# EAGLE design ADXL375_BOARD (EAGLE 9.6.1)
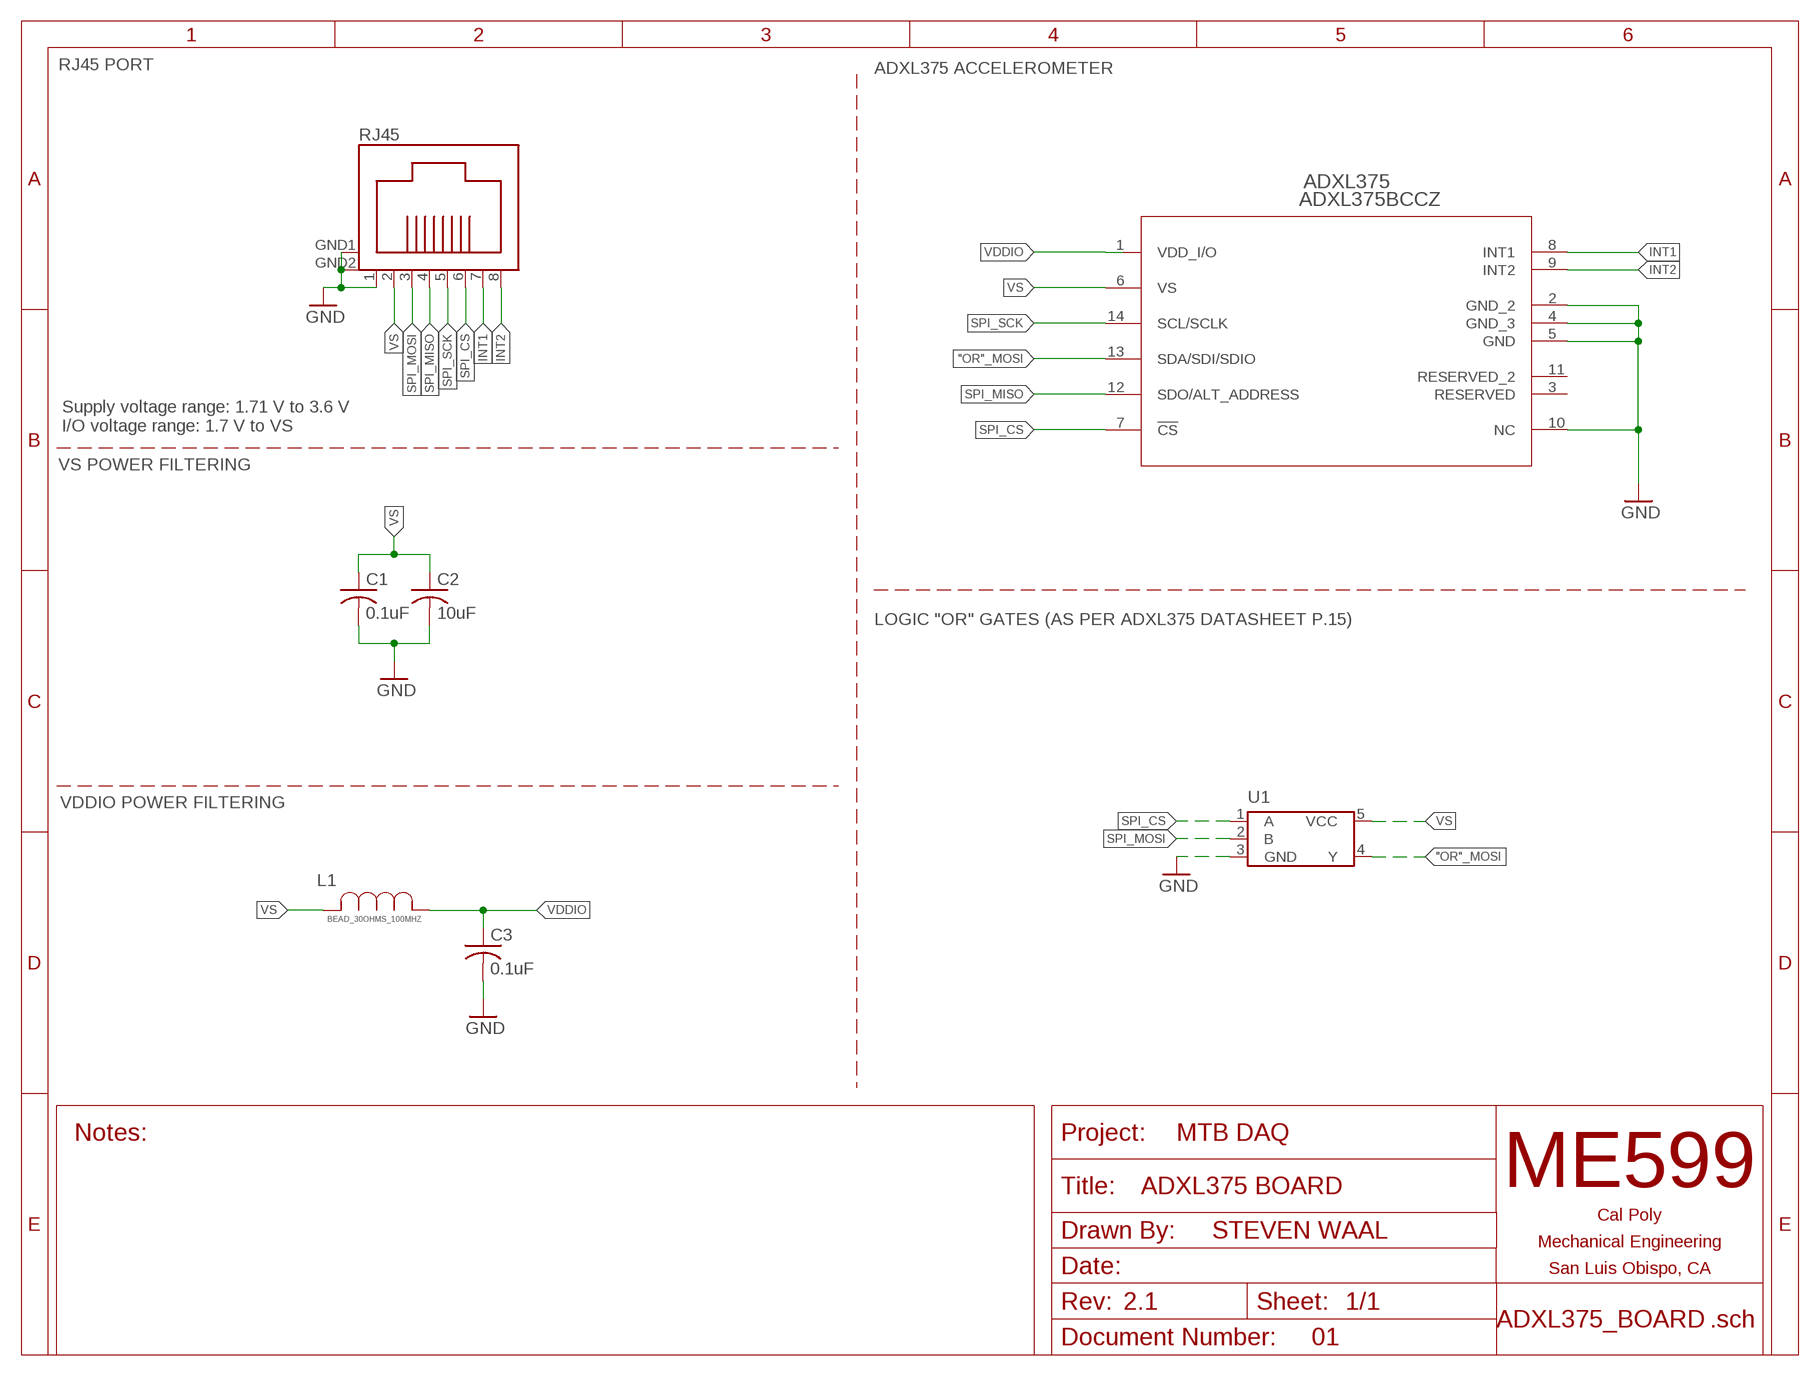
[diagram p0: schematic, sheet 1]
FRAME1 (TITLEBLOCK): AUTHOR: STEVEN WAAL; BOARD_NAME: ADXL375 BOARD; DOC_NUM: 01; PROJECT_NAME: MTB DAQ; REVISION: 2.1

## Parts
ADXL375  ADXL375BCCZ  [LGA_CC-14-1]
C1  0.1uF  C-USC0805  [C0805]
C2  10uF  C-USC0805  [C0805]
C3  0.1uF  C-USC0805  [C0805]
L1  BEAD_30OHMS_100MHZ  [IND_BOURNS_MH2029]
RJ45  RJ45_SURFACE_MOUNT  [RJ45_SURFACE_MOUNT]
U1  SN74LVC1G32DCKR  [DCK5]

## Nets
"OR"_MOSI: ADXL375.13(SDA/SDI/SDIO) U1.4(Y)
GND: ADXL375.2(GND_2) ADXL375.4(GND_3) ADXL375.5(GND) ADXL375.10(NC) C1.2 C2.2 C3.2 RJ45.1 RJ45.GND1 RJ45.GND2 U1.3(GND)
INT1: ADXL375.8(INT1) RJ45.7
INT2: ADXL375.9(INT2) RJ45.8
SPI_CS: ADXL375.7(!CS) RJ45.6 U1.1(A)
SPI_MISO: ADXL375.12(SDO/ALT_ADDRESS) RJ45.4
SPI_MOSI: RJ45.3 U1.2(B)
SPI_SCK: ADXL375.14(SCL/SCLK) RJ45.5
VDDIO: ADXL375.1(VDD_I/O) C3.1 L1.1
VS: ADXL375.6(VS) C1.1 C2.1 L1.2 RJ45.2 U1.5(VCC)
Unconnected: ADXL375.3(RESERVED) ADXL375.11(RESERVED_2)

## Notes on the sheet
- RJ45 PORT | ADXL375 ACCELEROMETER
- Supply voltage range: 1.71 V to 3.6 V 
  I/O voltage range: 1.7 V to VS
- VS POWER FILTERING
- LOGIC "OR" GATES (AS PER ADXL375 DATASHEET P.15)
- VDDIO POWER FILTERING

## Library data of the parts
ADXL375 = DigikeyLibrary:ADXL375BCCZ: Accelerometer X, Y, Z Axis ±200g 0.05Hz ~ 1.6kHz 14-LGA (3x5) Digikey Part No: ADXL375BCCZ-ND Link: https://www.digikey.com/product-detail/en/analog-devices-inc/ADXL375BCCZ/ADXL375BCCZ-ND/4376342; MANUFACTURER_PART_NUMBER: ADXL375BCCZ; VENDOR: Analog Devices Inc
C1-C3 = DigikeyLibrary:C-US: CAPACITOR, American symbol; SPICEPREFIX: C
L1 = DigikeyLibrary:BEAD_30OHMS_100MHZ: 30 Ohms @ 100MHz 1 Power, Signal Line Ferrite Bead 0805 (2012 Metric) 3A 25 mOhm Digikey Part No: MH2029-300YCT-ND Link: https://www.digikey.com/product-detail/en/bourns-inc/MH2029-300Y/MH2029-300YCT-ND/3741761; MANUFACTURER_PART_NUMBER: MH2029300Y; VENDOR: Bourns Electronics
RJ45 = DigikeyLibrary:RJ45_SURFACE_MOUNT: Digikey Part No. RJCSE538001CT-ND MFG. Amphenol ICC (Commercial Products) MFG. PART NO. RJCSE538001
U1 = DigikeyLibrary:SN74LVC1G32DCKR: Logic "OR" Gate Digi-Key Part Number 296-9848-1-ND Manufacturer Texas Instruments Manufacturer Part Number SN74LVC1G32DCKR Customer Reference Number Description IC GATE OR 1CH 2-INP SC70-5 Manufacturer Standard Lead Time 6 Weeks Detailed Description OR Gate IC 1 Channel SC-70-5; BUILT_BY: EMA_UL_Team; MANUFACTURER: Texas Instruments; MANUFACTURER_PART_NUMBER: SN74LVC1G32DCKR; VENDOR: Texas Instruments

## Board
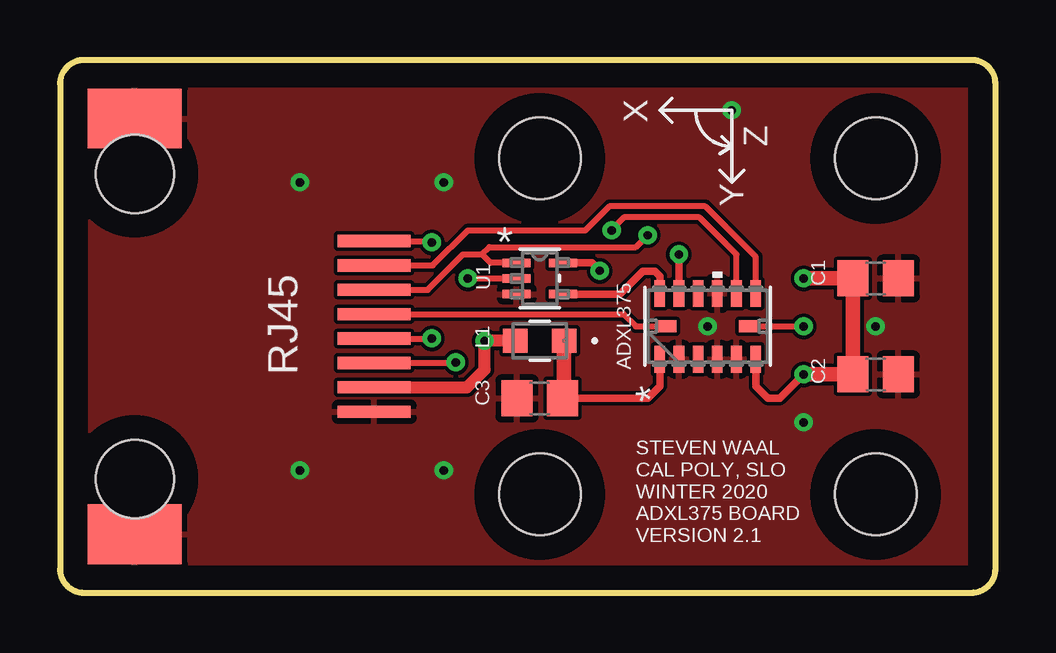
[diagram p1: board, top side]
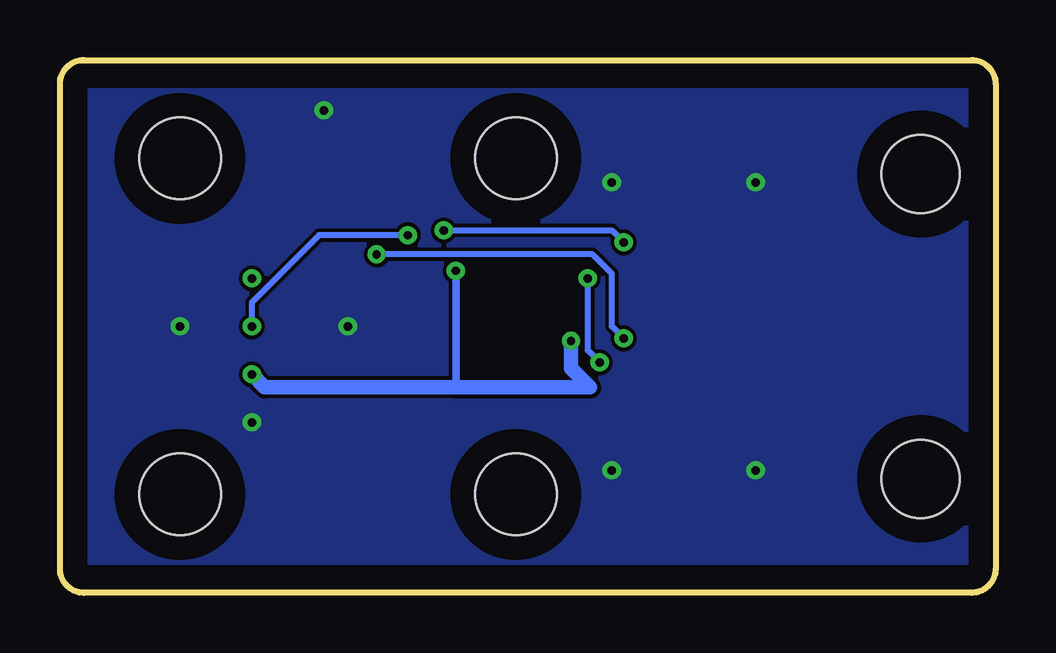
[diagram p2: board, bottom side, seen from below]

Size 39 x 22.2 mm. Coordinates in mm from the lower left corner, seen from the top.
Outline: 39,1 39,21.2 arc90 38,22.2 1,22.2 arc90 0,21.2 0,1 arc90 1,0 38,0 arc90 39,1
Copper layers (1*16): Top 0.035mm / dielectric 1.5mm / Bottom 0.035mm
Design rules "default *": minimum track width 6mil, minimum drill 0.35mm, track to track 6mil, track to pad 6mil, pad to pad 6mil, via to via 6mil, smd to smd 6mil, copper to edge 40mil, drill to drill 6mil, minimum pad ring 10mil, minimum via ring 8mil, stop-mask expansion 4mil, vias tented up to drill 20mil, thermal gap 10mil
Holes 3.4 mm at 20,4.1 34,18.1 34,4.1 20,18.1

### Footprints (pad centres in the part's own frame; a part is rotated, then mirrored left to right if it is on the bottom)
LGA_CC-14-1 = smd 1.118 x 0.449: 1 -1.371,2; 2 -1.371,1.2; 3 -1.371,0.4; 4 -1.371,-0.4; 5 -1.371,-1.2; 6 -1.371,-2; 8 1.371,-2; 9 1.371,-1.2; 10 1.371,-0.4; 11 1.371,0.4; 12 1.371,1.2; 13 1.371,2 | smd 0.5 x 0.813: 7 0,-1.718; 14 0,1.718
C0805 = smd 1.3 x 1.5: 1 -0.95,0; 2 0.95,0
IND_BOURNS_MH2029 = smd 1.016 x 1.016: 1 -1.016,0; 2 1.016,0
RJ45_SURFACE_MOUNT = smd 0.508 x 3.048: 1 3.556,0; 2 2.54,0; 3 1.524,0; 4 0.508,0; 5 -0.508,0; 6 -1.524,0; 7 -2.54,0; 8 -3.556,0 | smd 2.489 x 3.912: GND1 8.661,-9.982; GND2 -8.661,-9.982 | hole 3.251: 6.35,-9.982; -6.35,-9.982
DCK5 = smd 1.168 x 0.356: 1 -0.965,0.65; 2 -0.965,0; 3 -0.965,-0.65; 4 0.965,-0.65; 5 0.965,0.65

### Placement (x,y rotation side)
ADXL375  27,11.1 90 top
C1  34,13.1 0 top
C2  34,9.1 0 top
C3  20,8.1 180 top
L1  20,10.5 180 top
RJ45  13.1,11.1 270 top
U1  20,13.1 0 top

### Tracks (layer width: path | path; a pad name or v marks a point on that pad's centre or on a via)
"OR"_MOSI
  Top 0.305: U1.4 23.35,12.45 24.3,13.4 24.8,13.4 25,13.2 ADXL375.13
GND  (via drill 0.35)
  other vias: 28,20.1 16,17.1 10,5.1 16,5.1 34,11.1 10,17.1 31,7.1 27,11.1
  pour Top: -2,23.1 -2,-1.9 40,-1.9 40,23.1
  pour Bottom: -2,23.1 -2,-0.9 40,-0.9 40,23.1
INT1
  Top 0.254: ADXL375.8 29,14 26.9,16.1 22.9,16.1 21.9,15.1 17,15.1 15.54,13.64 RJ45.7
INT2  (via drill 0.35)
  Top 0.254: ADXL375.9 28.2,14.1 26.66,15.64 23.5,15.64 23,15.14 | RJ45.8 15.44,14.66 v15.5,14.6
  Top 0.305: 23,15.14 v23,15.1
  Bottom 0.254: v23,15.1 16,15.1 v15.5,14.6
SPI_CS  (via drill 0.35)
  Top 0.254: ADXL375.7 v31,11.1 | U1.1 17.95,13.75 17.6,14.1 | RJ45.6 15.32,12.62 16.8,14.1 17.6,14.1 | 17.6,14.1 17.9,14.4 24,14.4 v24.5,14.9
  Bottom 0.254: v31,11.1 31,12.1 28.2,14.9 v24.5,14.9
SPI_MISO  (via drill 0.35)
  Top 0.254: RJ45.4 v15.49,10.59 v15.5,10.6
  Top 0.305: ADXL375.12 v25.8,14.1
  Bottom 0.254: v25.8,14.1 16.8,14.1 16,13.3 16,11.1 v15.5,10.6
SPI_MOSI  (via drill 0.35)
  Top 0.254: v17,13.1 U1.2 | RJ45.3 16.48,9.58 v16.5,9.6
  Bottom 0.254: v16.5,9.6 17,10.1 v17,13.1
SPI_SCK
  Top 0.254: RJ45.5 23.49,11.61 24,11.1 ADXL375.14
VDDIO
  Top 0.305: ADXL375.1 25,8.6 24.5,8.1 C3.1
  Top 0.61: L1.1 21.02,8.17 C3.1
VS  (via drill 0.35)
  Top 0.305: ADXL375.6 29,8.6 29.5,8.1 30,8.1 v31,9.1 | U1.5 22.17,13.75 v22.5,13.42
  Top 0.5: L1.2 v17.7,10.5 17.7,9.3 16.96,8.56 RJ45.2
  Top 0.61: v31,13.1 C1.1 C2.1 v31,9.1
  Bottom 0.305: v22.5,13.42 22.5,8.56
  Bottom 0.61: v31,9.1 30.46,8.56 22.5,8.56 16.9,8.56 17.7,9.36 v17.7,10.5

### Text on the board
tPlace: X | Z | Y | STEVEN WAAL / CAL POLY, SLO / WINTER 2020 / ADXL375 BOARD / VERSION 2.1